# Altium project LaserDiode_Driver.PrjPcb (part 2 of 2)
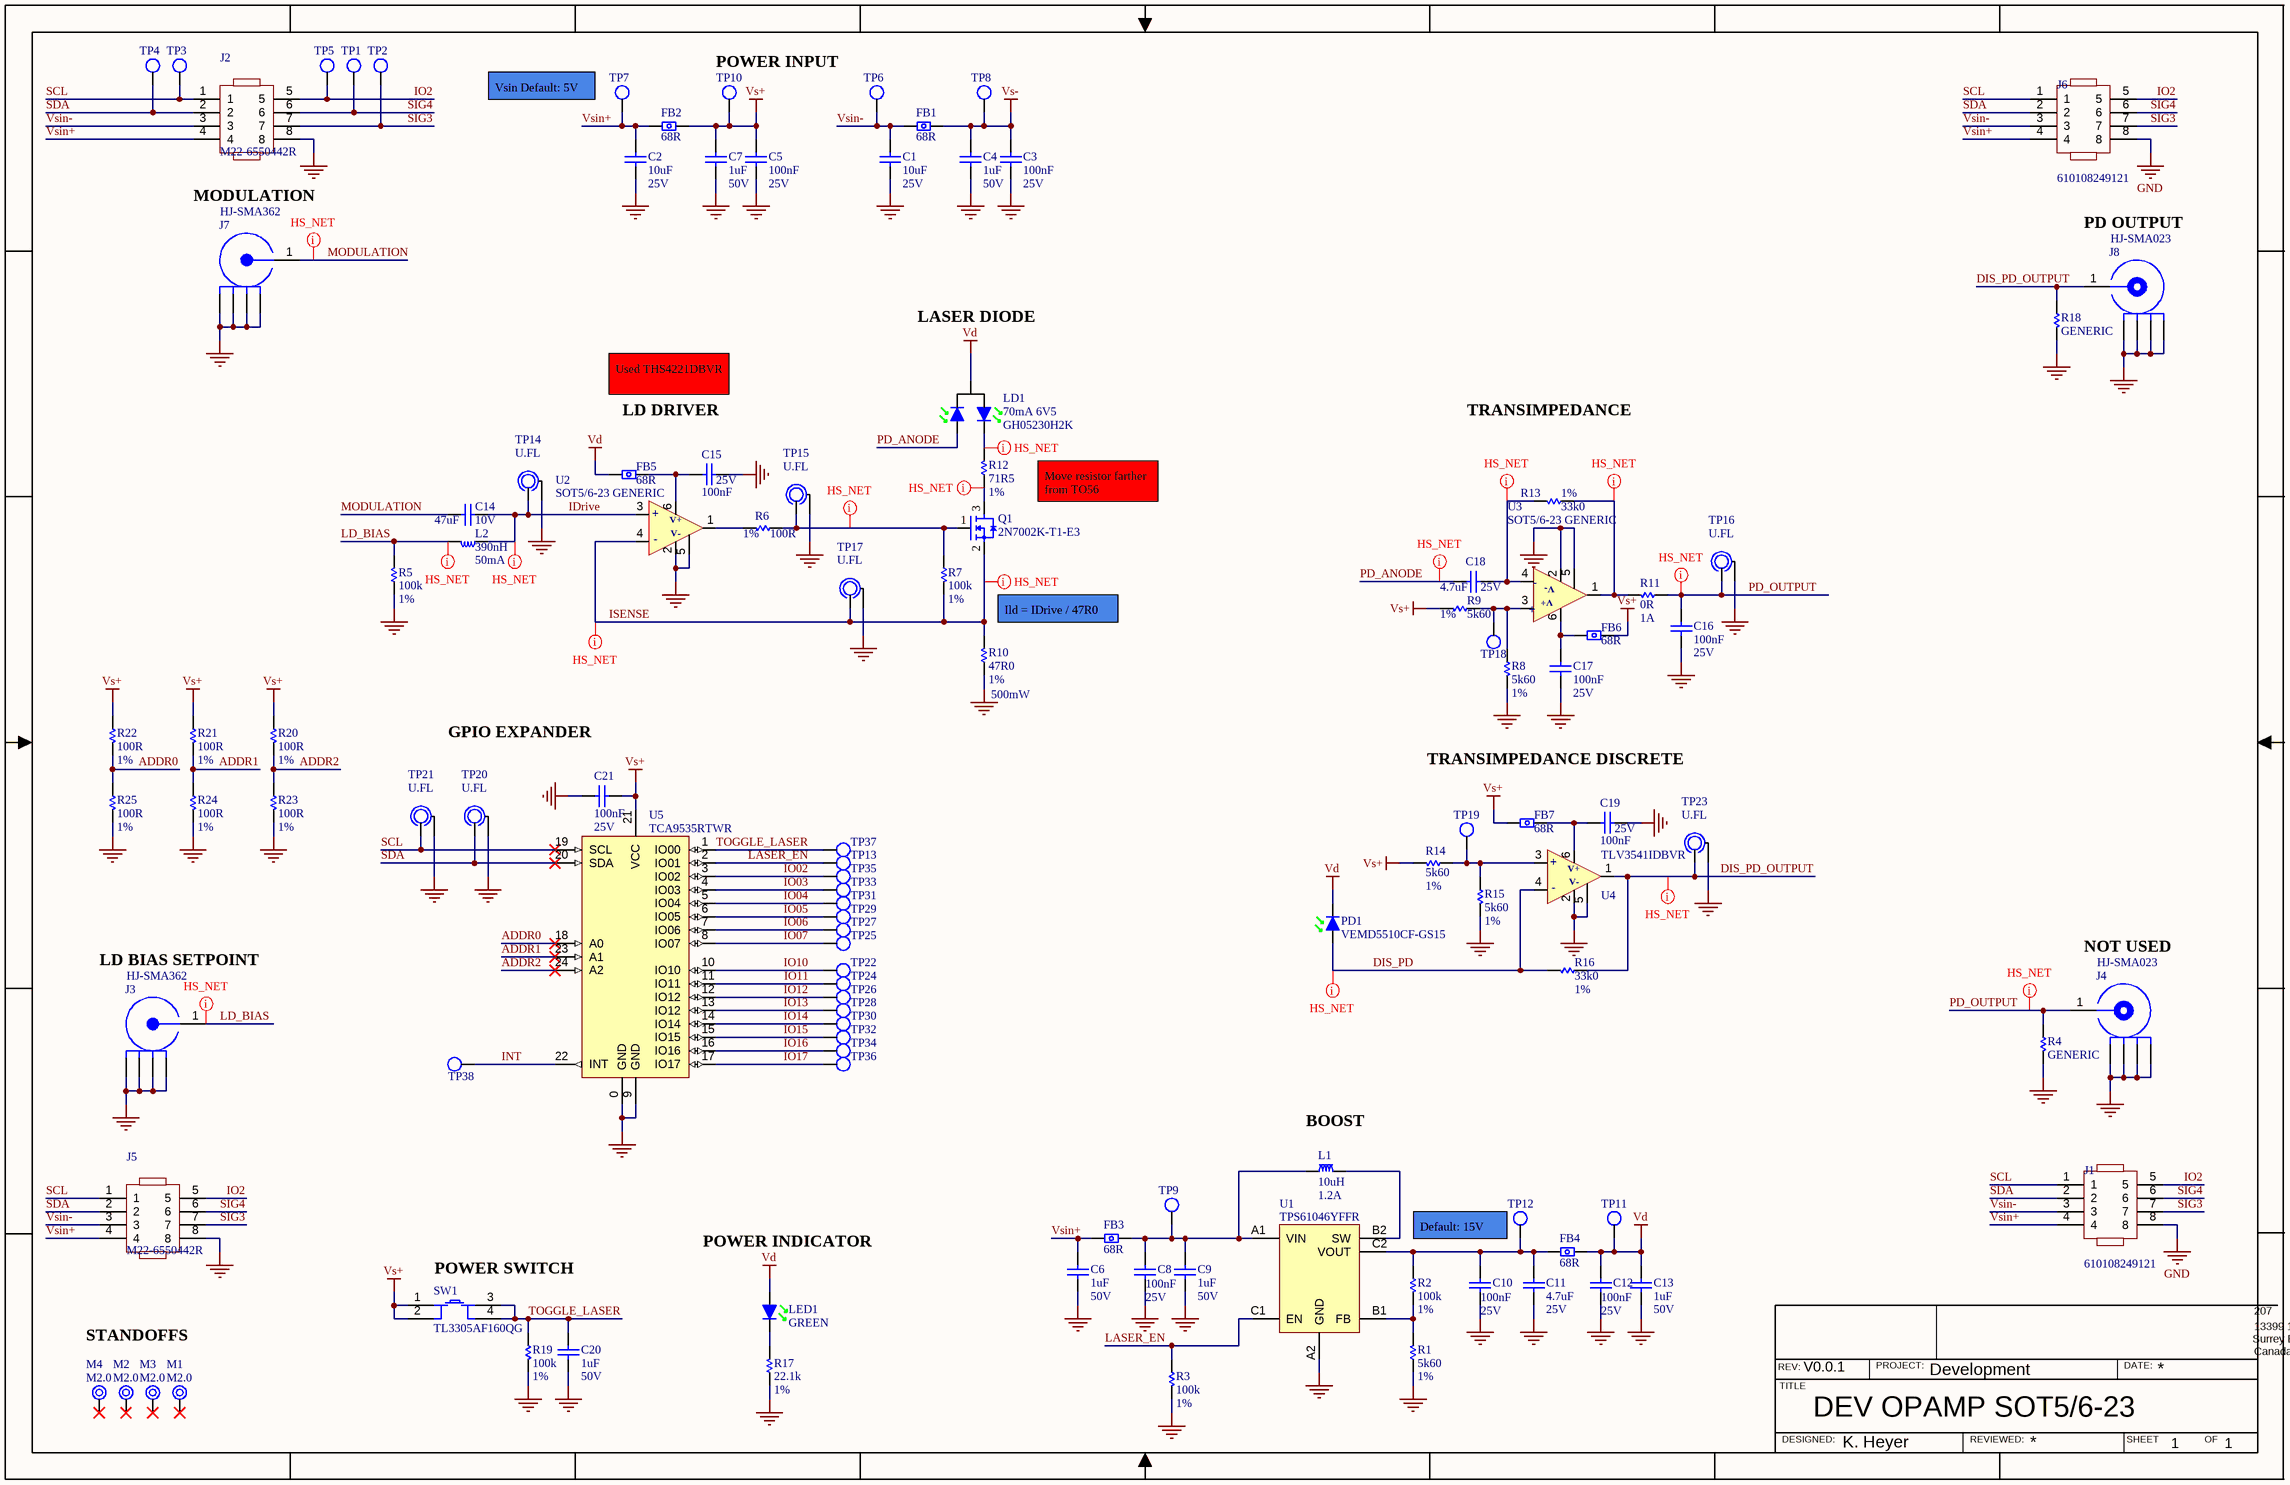
[diagram p1: LaserDiode_Driver.SchDoc]

## Sheet LaserDiode_Driver.SchDoc: DEV OPAMP SOT5/6-23 (continued)

### Library data of the parts
C1 C2 = CAP CER 10uF 25V X5R 0805: Cap Ceramic 10uF 25V X5R 10% SMD 0805 85°C Embossed T/R; Manufacturer: Samsung; Manufacturer Part Number: CL21A106KAYNNNE; Supplier 1: Digi-Key; RoHS: Yes; Category: Ceramic Capacitors; Stock 1: 2266338; Pricing 1: 2000=0.03549, 4000=0.03247 (USD); Mount: Surface Mount; Case/Package: 0805; Case Code (Metric): 2012; Case Code (Imperial): 0805; Min Operating Temperature: -55°C; Max Operating Temperature: 85°C; Package Quantity: 1; Packaging: Tape and Reel; Capacitance: 10uF; Tolerance: 10%; Dielectric: X5R; Series: CL; Construction: Flat; Length: 2mm; Width: 0.049inch; Height: 1.25mm; Depth: 1.25mm; Thickness: 0.057inch; Radiation Hardening: No; RoHS Compliant: Yes; ComponentLink1URL: https://datasheet.ciiva.com/25796/cl21a106kaynnne-25796720.pdf?src-supplier=Digi-Key; ComponentLink1Description: https://datasheet.ciiva.com/25796/cl21a106kaynnne-25796720.pdf?src-supplier=Digi-Key; ComponentLink2URL: https://datasheet.ciiva.com/26838/getdatasheetpartid-357558-26838583.pdf?src-supplier=Verical; ComponentLink2Description: https://datasheet.ciiva.com/26838/getdatasheetpartid-357558-26838583.pdf?src-supplier=Verical; Supplier Part Number 1: 1276-2891-2-ND
C3 C5 C8 C10 C12 C15-C17 C19 C21 = CAP CER 100nF 25V X5R 0402: Cap Ceramic 0.1uF 25V X5R 10% Pad SMD 0402 85¡ãC T/R / Multi Layer Ceramic Capacitor (MLCC); Manufacturer: Samsung; Manufacturer Part Number: CL05A104KA5NNNC; Supplier 1: Digi-Key; RoHS: Yes; Category: Ceramic Capacitors; Stock 1: 8053194; Pricing 1: 1=0.10000, 10=0.01100, 50=0.00600, 100=0.00490, 500=0.00346, 1000=0.00272, 2500=0.00248, 5000=0.00228 (USD); Mount: Surface Mount; Case/Package: 0402; Case Code (Metric): 1005; Case Code (Imperial): 0402; Min Operating Temperature: -55°C; Max Operating Temperature: 85°C; Capacitance: 100nF; Tolerance: 10%; Dielectric: X5R; Packaging: Tape and Reel; Package Quantity: 1; Voltage: 25V; Series: CL; Construction: Flat; Voltage Rating (DC): 25V; Length: 1mm; Width: 0.02inch; Height: 0.5mm; Thickness: 0.022inch; Depth: 0.5mm; Radiation Hardening: No; Lead Free: Lead Free; ComponentLink1URL: https://datasheet.ciiva.com/25802/cl05a104ka5nnnc-25802704.pdf?src-supplier=Digi-Key; ComponentLink1Description: https://datasheet.ciiva.com/25802/cl05a104ka5nnnc-25802704.pdf?src-supplier=Digi-Key; ComponentLink2URL: https://datasheet.ciiva.com/26838/getdatasheetpartid-357412-26838142.pdf?src-supplier=Verical; ComponentLink2Description: https://datasheet.ciiva.com/26838/getdatasheetpartid-357412-26838142.pdf?src-supplier=Verical; ComponentLink3URL: https://datasheet.ciiva.com/16437/cl05a104ka5nnnc-16437369.pdf?src-supplier=Future+Electronics; ComponentLink3Description: https://datasheet.ciiva.com/16437/cl05a104ka5nnnc-16437369.pdf?src-supplier=Future+Electronics; ComponentLink4URL: https://datasheet.ciiva.com/26309/mlcc-catalogdownload2013-eng-26309014.pdf?src-supplier=Distrelec; ComponentLink4Description: https://datasheet.ciiva.com/26309/mlcc-catalogdownload2013-eng-26309014.pdf?src-supplier=Distrelec; Supplier Part Number 1: 1276-1043-1-ND
C4 C6 C7 C9 C13 C20 = CAP CER 1uF 50V X5R 0603: Multilayer Ceramic Capacitors (High dielectric type), 50V, 1 uF, ± 10 %, 0603, X5R, RoHS; Manufacturer: Taiyo Yuden; Manufacturer Part Number: UMK107BJ105KA-T; Tolerance: 10%; Supplier 1: Digi-Key; RoHS: Yes; Category: Ceramic Capacitors; Stock 1: 955108; Pricing 1: 1=0.19000, 10=0.12900, 50=0.07760, 100=0.06560, 500=0.04484, 1000=0.03968 (USD); Mount: Surface Mount; Case/Package: 0603; Number of Pins: 2; Case Code (Metric): 1608; Case Code (Imperial): 0603; Contact Plating: Nickel; Min Operating Temperature: -55°C; Max Operating Temperature: 85°C; Capacitance: 1uF; Packaging: Tape and Reel; Package Quantity: 1; Dielectric: X5R; Voltage Rating (DC): 50V; Termination: SMD/SMT; Series: M; Construction: Flat; Length: 1.6mm; Width: 0.031inch; Height: 0.8mm; Depth: 0.8mm; Thickness: 0.035inch; Radiation Hardening: No; RoHS Compliant: Yes; REACH SVHC: Unknown; Halogen Free: Halogen Free; ComponentLink1URL: https://datasheet.ciiva.com/134/umk107bj105ka-t-ss-134740.pdf?src-supplier=Digi-Key; ComponentLink1Description: https://datasheet.ciiva.com/134/umk107bj105ka-t-ss-134740.pdf?src-supplier=Digi-Key; ComponentLink2URL: https://datasheet.ciiva.com/11601/umk107bj105ka-t-ss-11601811.pdf?src-supplier=Avnet; ComponentLink2Description: https://datasheet.ciiva.com/11601/umk107bj105ka-t-ss-11601811.pdf?src-supplier=Avnet; ComponentLink3URL: https://datasheet.ciiva.com/5744/1697715-5744913.pdf?src-supplier=Farnell; ComponentLink3Description: https://datasheet.ciiva.com/5744/1697715-5744913.pdf?src-supplier=Farnell; ComponentLink4URL: https://datasheet.ciiva.com/30199/43umk107bj105ka-t-30199791.pdf?src-supplier=Onlinecomponents.com; ComponentLink4Description: https://datasheet.ciiva.com/30199/43umk107bj105ka-t-30199791.pdf?src-supplier=Onlinecomponents.com; ComponentLink5URL: https://datasheet.ciiva.com/15922/336umk107bj105ka-t-15922611.pdf?src-supplier=Onlinecomponents.com; ComponentLink5Description: https://datasheet.ciiva.com/15922/336umk107bj105ka-t-15922611.pdf?src-supplier=Onlinecomponents.com; ComponentLink6URL: https://datasheet.ciiva.com/5427/mlcc-all-e-541559-5427036.pdf?src-supplier=Mouser; ComponentLink6Description: https://datasheet.ciiva.com/5427/mlcc-all-e-541559-5427036.pdf?src-supplier=Mouser; ComponentLink7URL: https://datasheet.ciiva.com/7975/mlcc-all-e-7975898.pdf?src-supplier=Element14; ComponentLink7Description: https://datasheet.ciiva.com/7975/mlcc-all-e-7975898.pdf?src-supplier=Element14; ComponentLink8URL: https://datasheet.ciiva.com/7975/1697715-7975608.pdf?src-supplier=Element14; ComponentLink8Description: https://datasheet.ciiva.com/7975/1697715-7975608.pdf?src-supplier=Element14; ComponentLink9URL: https://datasheet.ciiva.com/22694/1697715-22694278.pdf?src-supplier=Element14; ComponentLink9Description: https://datasheet.ciiva.com/22694/1697715-22694278.pdf?src-supplier=Element14; Supplier Part Number 1: 587-2400-1-ND
C11 C18 = CAP CER 4.7uF 25V X5R 0805: Cap Ceramic 4.7uF 25V X5R 10% SMD 0805 85C Embossed T/R; Manufacturer: Samsung; Manufacturer Part Number: CL21A475KAQNNNE; Supplier 1: Digi-Key; RoHS: Yes; Category: Ceramic Capacitors; Stock 1: 3540; Pricing 1: 1=0.11000, 10=0.08000, 50=0.04520, 100=0.03740, 500=0.02624, 1000=0.02172 (USD); Mount: Surface Mount; Case/Package: 0805; Case Code (Metric): 2012; Case Code (Imperial): 0805; Min Operating Temperature: -55°C; Max Operating Temperature: 85°C; Package Quantity: 1; Packaging: Tape and Reel; Capacitance: 4.7uF; Tolerance: 10%; Dielectric: X5R; Voltage Rating (DC): 25V; Series: CL; Construction: Flat; Length: 2mm; Width: 0.049inch; Height: 1.25mm; Thickness: 0.055inch; Depth: 1.25mm; Radiation Hardening: No; Lead Free: Lead Free; RoHS Compliant: Yes; ComponentLink1URL: https://datasheet.ciiva.com/25798/cl21a475kaqnnne-25798882.pdf?src-supplier=Digi-Key; ComponentLink1Description: https://datasheet.ciiva.com/25798/cl21a475kaqnnne-25798882.pdf?src-supplier=Digi-Key; Supplier Part Number 1: 1276-1244-1-ND
C14 = CAP CER 47uF 10V X7R 1210: CAP CER 47UF 10V 20% X7R 1210; Manufacturer: Murata; Manufacturer Part Number: GRM32ER71A476ME15L; Supplier 1: Newark; RoHS: Yes; Category: Ceramic Capacitors; Stock 1: 39686; Pricing 1: 1=0.19500, 10=0.19500, 25=0.19500, 50=0.19500, 100=0.19500 (USD); Mount: Surface Mount; Case/Package: 1210; Case Code (Metric): 3225; Case Code (Imperial): 1210; Min Operating Temperature: -55°C; Max Operating Temperature: 125°C; Capacitance: 47uF; Tolerance: 20%; Packaging: Tape and Reel; Package Quantity: 1; Voltage Rating (DC): 10V; Termination: SMD/SMT; Voltage: 10V; Series: GRM; Construction: Flat; Length: 3.2mm; Width: 0.098inch; Height: 2.5mm; Thickness: 0.106inch; Depth: 2.5mm; Radiation Hardening: No; Reach SVHC Compliant: Yes; Lead Free: Lead Free; RoHS Compliant: Yes; ComponentLink1URL: https://datasheet.ciiva.com/46441/1754712-46441338.pdf?src-supplier=Element14; ComponentLink1Description: https://datasheet.ciiva.com/46441/1754712-46441338.pdf?src-supplier=Element14; ComponentLink2URL: https://datasheet.ciiva.com/6264/partnumbering-e-01-6264587.pdf?src-supplier=Digi-Key; ComponentLink2Description: https://datasheet.ciiva.com/6264/partnumbering-e-01-6264587.pdf?src-supplier=Digi-Key; ComponentLink3URL: https://datasheet.ciiva.com/6264/partnumbering-e-01-6264586.pdf?src-supplier=Digi-Key; ComponentLink3Description: https://datasheet.ciiva.com/6264/partnumbering-e-01-6264586.pdf?src-supplier=Digi-Key; ComponentLink4URL: https://datasheet.ciiva.com/6264/partnumbering-e-01-6264588.pdf?src-supplier=Digi-Key; ComponentLink4Description: https://datasheet.ciiva.com/6264/partnumbering-e-01-6264588.pdf?src-supplier=Digi-Key; ComponentLink5URL: https://datasheet.ciiva.com/11606/product-11606523.pdf?src-supplier=Avnet; ComponentLink5Description: https://datasheet.ciiva.com/11606/product-11606523.pdf?src-supplier=Avnet; ComponentLink6URL: https://datasheet.ciiva.com/16497/product-16497006.pdf?src-supplier=Future+Electronics; ComponentLink6Description: https://datasheet.ciiva.com/16497/product-16497006.pdf?src-supplier=Future+Electronics; Supplier Part Number 1: 40X5909; Dielectric: X7R
FB1-FB7 = FB 68R 400mA 310mR 0402: Ferrite Beads Multi-Layer 68Ohm 25% 100MHz 400mA 310mOhm DCR 0402 T/R; Manufacturer: Taiyo Yuden; Manufacturer Part Number: BK1005LL680-T; DC Resistance (DCR): 310mR; Number of Lines: 1; Shielding: Unshielded; Supplier 1: Digi-Key; RoHS: Yes; Category: Ferrite Beads and Chips; Stock 1: 9707; Pricing 1: 1=0.10000, 10=0.04100, 25=0.03640, 50=0.03300, 100=0.02970, 250=0.02176, 500=0.01584, 1000=0.01551, 5000=0.01056 (USD); Mount: Surface Mount; Case/Package: 0402; Number of Pins: 2; Case Code (Metric): 1005; Case Code (Imperial): 0402; Core Material: Ferrite; Min Operating Temperature: -55°C; Max Operating Temperature: 125°C; Packaging: Tape and Reel; Package Quantity: 1; Impedance: 68R; Tolerance: 25%; Max DC Current: 400mA; Termination: SMD/SMT; Test Frequency: 100MHz; Max Current Rating: 400mA; Series: BK; Frequency: 100MHz; Length: 0.039inch; Width: 0.02inch; Height: 0.022inch; Depth: 0.55mm; Halogen Free: Halogen Free; Lead Free: Lead Free; REACH SVHC: Unknown; ComponentLink1URL: https://datasheet.ciiva.com/1013/bk1005ll680-t-ss-1013936.pdf?src-supplier=Digi-Key; ComponentLink1Description: https://datasheet.ciiva.com/1013/bk1005ll680-t-ss-1013936.pdf?src-supplier=Digi-Key; ComponentLink2URL: https://datasheet.ciiva.com/1013/mlci07-e-1013935.pdf?src-supplier=Digi-Key; ComponentLink2Description: https://datasheet.ciiva.com/1013/mlci07-e-1013935.pdf?src-supplier=Digi-Key; ComponentLink3URL: https://datasheet.ciiva.com/1013/mlci07-e-1013937.pdf?src-supplier=Digi-Key; ComponentLink3Description: https://datasheet.ciiva.com/1013/mlci07-e-1013937.pdf?src-supplier=Digi-Key; Supplier Part Number 1: 587-1860-1-ND
J1 J6 = CONN HDR 08 MALE RA 2 ROW: SMT Angled Pin Header WR-PHD, Pitch 2.54 mm, Dual Row, 8 pins; Manufacturer: Wurth Electronics; Number of Positions: 8; Current Rating: 3A; Gender: Male; Voltage Rating: 250V; Pitch: 0.1inch; Supplier 1: Newark; Manufacturer Part Number: 610108249121; RoHS: Yes; Category: Connectors; Stock 1: 350; Pricing 1: 1=1.53000, 10=1.52000, 25=1.49000, 50=1.46000, 100=1.36000 (USD); Mount: Surface Mount; Contact Plating: Gold; Contact Material: Copper Alloy; Insulation Color: Black; Insulation Material: Nylon; Contact Shape: Square; Connector Type: Header; Fastening Type: Pull; Packaging: Cut Tape; Number of Rows: 2; Termination: Solder; Flammability Rating: UL94 V-0; RoHS Compliant: Yes; ComponentLink1URL: http://www.farnell.com/cad/1889791.pdf?src-supplier=Element14; ComponentLink1Description: http://www.farnell.com/cad/1889791.pdf?src-supplier=Element14; Supplier Part Number 1: 72Y1215; Number of Pins: 8; Color: Black; Contact Finish - Mating: GOLD; Number of Contacts: 8; Series: WR-PHD; Contact Type: Male Pin; Row Spacing: 0.1inch; Contact Mating Length: 0.236inch; ComponentLink2URL: https://katalog.we-online.de/em/datasheet/6101xx249121.pdf?src-supplier=Digi-Key; ComponentLink2Description: https://katalog.we-online.de/em/datasheet/6101xx249121.pdf?src-supplier=Digi-Key; ComponentLink3URL: https://www.distrelec.bizhttp://katalog.we-online.de/em/datasheet/6101xx249121.pdf?mime=application%2Fpdf&src-supplier=Distrelec; ComponentLink3Description: https://www.distrelec.bizhttp://katalog.we-online.de/em/datasheet/6101xx249121.pdf?mime=application%2Fpdf&src-supplier=Distrelec
J2 J5 = CONN HDR 08 FEMALE RA 2 ROW: Conn Socket Strip RCP 8 POS 2mm Solder RA SMD T/R; Manufacturer: Harwin; Current Rating: 2A; Number of Positions: 8; Connector Type: Receptacle,Forked; Supplier 1: Newark; Manufacturer Part Number: M22-6550442R; RoHS: Yes; Category: Connectors; Stock 1: 750; Pricing 1: 1=1.17000, 100=0.91900, 250=0.84000, 500=0.76600, 1000=0.71200 (USD); Mount: Surface Mount; Contact Material: Bronze; Contact Plating: Gold; Contact Shape: Square; Insulation Material: Polymer; Insulation Color: Black; Packaging: Cut Tape; Number of Rows: 2; Termination: Solder; Fastening Type: Push,Pull; RoHS Compliant: Yes; Flammability Rating: UL94 V-0; ComponentLink1URL: https://cdn.harwin.com/pdfs/M22-655R.pdf?src-supplier=Digi-Key; ComponentLink1Description: https://cdn.harwin.com/pdfs/M22-655R.pdf?src-supplier=Digi-Key; Supplier Part Number 1: 45AJ6425; Min Operating Temperature: -40°C; Max Operating Temperature: 105°C
J3 J7 = CON SMA PIN SMD BRD EDGE HJ-SMA362
J4 J8 = CON SMA BORE SMD BRD EDGE HJ-SMA023
L1 = IND 10uH 1.2A 180mR 4040 NRS4018T100MDGJ: Inductor Power Shielded Wirewound 10uH 20% 100KHz Ferrite 1.2A 0.18Ohm DCR 1515 T/R; Manufacturer: Taiyo Yuden; Self Resonant Frequency: 25MHz; Saturation Current: 1.3A; DC Resistance (DCR): 180mR; Supplier 1: Newark; Manufacturer Part Number: NRS4018T100MDGJ; RoHS: Yes; Category: Fixed Inductors; Stock 1: 105000; Pricing 1: 3500=0.14600, 7000=0.14500 (CAD); Mount: Surface Mount; Case/Package: 4018; Number of Pins: 2; Core Material: Ferrite; Min Operating Temperature: -25°C; Max Operating Temperature: 125°C; Package Quantity: 3500; Packaging: Tape and Reel; Tolerance: 20%; Inductance: 10uH; Shielding: Shielded; Max DC Current: 1.2A; Termination: SMD/SMT; Resistor Type: Wirewound; Test Frequency: 100kHz; Inductance Tolerance: 20%; RMS Current (Irms): 1.2A; Series: NRS; Length: 4mm; Width: 0.157inch; Height: 1.8mm; Height - Seated (Max): 0.071inch; Depth: 4.2mm; Lead Pitch: 2.8mm; Radiation Hardening: No; Halogen Free: Halogen Free; RoHS Compliant: Yes; Lead Free: Lead Free; Reach SVHC Compliant: Yes; ComponentLink1URL: https://datasheet.ciiva.com/7197/nrs4018t100mdgj-ss-7197570.pdf?src-supplier=Newark; ComponentLink1Description: https://datasheet.ciiva.com/7197/nrs4018t100mdgj-ss-7197570.pdf?src-supplier=Newark; ComponentLink2URL: https://datasheet.ciiva.com/25607/0900766b810b3cd2-25607943.pdf?src-supplier=RSComponents; ComponentLink2Description: https://datasheet.ciiva.com/25607/0900766b810b3cd2-25607943.pdf?src-supplier=RSComponents; ComponentLink3URL: https://datasheet.ciiva.com/8504/nrs4018t100mdgj-ss-8504500.pdf?src-supplier=Avnet; ComponentLink3Description: https://datasheet.ciiva.com/8504/nrs4018t100mdgj-ss-8504500.pdf?src-supplier=Avnet; Supplier Part Number 1: 26AC2706
L2 = IND HF 390nH 50mA 8R 0402: Inductor High Frequency Chip Unshielded Multi-Layer 390nH 5% 50MHz 6Q-Factor Ceramic 50mA 8Ohm DCR 0402 T/R; Manufacturer: TDK; Manufacturer Part Number: MLG1005SR39JT000; Core Material: Non-Magnetic; DC Resistance (DCR): 8R; Self Resonant Frequency: 300MHz; Supplier 1: Newark; RoHS: Yes; Category: Fixed Inductors; Stock 1: 9470; Pricing 1: 1=0.13000, 10=0.08700, 25=0.08200, 50=0.07600, 100=0.07100 (USD); Mount: Surface Mount; Case/Package: 0402; Case Code (Metric): 1005; Case Code (Imperial): 0402; Min Operating Temperature: -55°C; Max Operating Temperature: 125°C; Package Quantity: 10000; Packaging: Tape and Reel; Tolerance: 5%; Shielding: Unshielded; Inductance: 390nH; Test Frequency: 50MHz; Length: 0.039inch; Width: 0.02inch; Height - Seated (Max): 0.022inch; RoHS Compliant: Yes; ComponentLink1URL: https://datasheet.ciiva.com/29690/inductor-commercial-high-frequency-mlg-en-29690424.pdf?src-supplier=Digi-Key; ComponentLink1Description: https://datasheet.ciiva.com/29690/inductor-commercial-high-frequency-mlg-en-29690424.pdf?src-supplier=Digi-Key; ComponentLink2URL: https://datasheet.ciiva.com/29690/inductor-commercial-high-frequency-mlg-en-29690423.pdf?src-supplier=Digi-Key; ComponentLink2Description: https://datasheet.ciiva.com/29690/inductor-commercial-high-frequency-mlg-en-29690423.pdf?src-supplier=Digi-Key; ComponentLink3URL: https://datasheet.ciiva.com/29690/inductor-commercial-high-frequency-mlg-en-29690425.pdf?src-supplier=Digi-Key; ComponentLink3Description: https://datasheet.ciiva.com/29690/inductor-commercial-high-frequency-mlg-en-29690425.pdf?src-supplier=Digi-Key; Supplier Part Number 1: 69AH1243
LD1 = LD TYPE A GREEN 30mW GH05230H2K: Manufacturer: Sharp; Supplier 1: Mouser; Stock 1: 1976; Pricing 1: 1=6.31000, 10=4.45000, 50=4.45000, 100=3.64000, 1000=2.99000, 10000=2.89000 (USD); Supplier Part Number 1: 852-GH05230H2K
LED1 = LED GREEN CLEAR 0402: LED GREEN CLEAR 0402 SMD; Manufacturer: Kingbright; Manufacturer Part Number: APHHS1005CGCK; Forward Current: 20mA; Forward Voltage: 2.1V; Luminous Intensity: 50mcd; Viewing Angle: 120°; Lens Style: Clear,Flat; Dominant Wavelength: 570nm; Number of LEDs: 1; Supplier 1: Future Electronics; RoHS: Yes; Category: LEDs; Stock 1: 6000; Pricing 1: 2000=0.08900, 6000=0.07440, 10000=0.07360, 30000=0.07200, 50000=0.07120 (USD); Mount: Surface Mount; Case/Package: 0402; Number of Pins: 2; Color: Green; Case Code (Metric): 1005; Case Code (Imperial): 0402; Lens Color: Clear; Min Operating Temperature: -40°C; Max Operating Temperature: 85°C; Packaging: Tape and Reel; Package Quantity: 2000; Test Current: 20mA; Series: APHHS; Illumination Color: Green; Wavelength: 570nm; Length: 1mm; Width: 0.5mm; Height: 0.6mm; Lead Free: Lead Free; RoHS Compliant: Yes; ComponentLink1URL: https://datasheet.ciiva.com/4688/aphhs1005cgck-38896-4688761.pdf?src-supplier=Mouser; ComponentLink1Description: https://datasheet.ciiva.com/4688/aphhs1005cgck-38896-4688761.pdf?src-supplier=Mouser; ComponentLink2URL: https://datasheet.ciiva.com/2113/aphhs1005cgck-2113972.pdf?src-supplier=Digi-Key; ComponentLink2Description: https://datasheet.ciiva.com/2113/aphhs1005cgck-2113972.pdf?src-supplier=Digi-Key; ComponentLink3URL: https://datasheet.ciiva.com/2113/aphhs1005cgck-2113973.pdf?src-supplier=Digi-Key; ComponentLink3Description: https://datasheet.ciiva.com/2113/aphhs1005cgck-2113973.pdf?src-supplier=Digi-Key; ComponentLink4URL: https://datasheet.ciiva.com/2113/aphhs1005cgck-2113974.pdf?src-supplier=Digi-Key; ComponentLink4Description: https://datasheet.ciiva.com/2113/aphhs1005cgck-2113974.pdf?src-supplier=Digi-Key; Supplier Part Number 1: 5437918
M1-M4 = MECH M2.0 UNPLATED
PD1 = DIODE PHOTO 540nm 20V VEMD5510CF-GS15: Photodiode PIN Chip 540nm 4-Pin SMD T/R; Manufacturer 1: Vishay Semiconductors; Response Time: 70ns; Max Reverse Voltage (DC): 20V; Dark Current: 200pA; Viewing Angle: 130°; Supplier 1: Mouser; Supplier Part Number 1: 78-VEMD5510CF-GS15; Manufacturer Part Number 1: VEMD5510CF-GS15; RoHS 1: Yes; Description 1: Photodiode PIN Chip 540nm 4-Pin SMD T/R; Stock 1: 678; Pricing 1: 1=2.27, 10=1.52, 50=1.52, 100=1.17, 1000=0.855, 10000=0.824 (USD); Mounting Technology: Surface Mount; Case/Package: SMD/SMT; Min Operating Temperature: -40°C; Max Operating Temperature: 100°C; Wavelength: 540nm; Diode Type: PIN; ComponentLink1URL: http://www.vishay.com/docs/84387/vemd5510cf.pdf?src-supplier=Digi-Key; ComponentLink1Description: http://www.vishay.com/docs/84387/vemd5510cf.pdf?src-supplier=Digi-Key
Q1 = TRANS NMOS 60V SOT-23-3 2N7002K-T1-E3: Trans MOSFET N-CH 60V 0.3A 3-Pin SOT-23 T/R - Tape and Reel (Alt: 2N7002K-T1-E3); Manufacturer: Vishay Siliconix; Nominal Vgs: 2V; Rds On Max: 2R; Input Capacitance: 30pF; Number of Elements: 1; Max Power Dissipation: 200mW; Continuous Drain Current (ID): 300mA; Drain to Source Breakdown Voltage: 70V; Drain to Source Resistance: 7.5R; Gate to Source Voltage (Vgs): 20V; Turn-Off Delay Time: 35ns; Power Dissipation: 350mW; Turn-On Delay Time: 25ns; Element Configuration: Single; Polarity: N-CHANNEL; Polarization: N; Supplier 1: Newark; Manufacturer Part Number: 2N7002K-T1-E3; RoHS: Yes; Category: MOSFETs; Stock 1: 29333; Pricing 1: 1=0.38000, 25=0.31000, 50=0.26100, 100=0.21200, 250=0.18600, 500=0.15900 (USD); Mount: Surface Mount; Case/Package: SOT-23-3; Number of Pins: 3; Weight: 0.050717oz; Min Operating Temperature: -55°C; Max Operating Temperature: 150°C; Packaging: Tape and Reel; Package Quantity: 1; Drain to Source Voltage (Vdss): 60V; Threshold Voltage: 2V; Number of Channels: 1; On-State Resistance: 2R; Series: TrenchFET®; Drain-source On Resistance-Max: 2R; Length: 3.04mm; Width: 1.4mm; Height: 1.02mm; Radiation Hardening: No; Lead Free: Lead Free; RoHS Compliant: Yes; ComponentLink1URL: https://datasheet.ciiva.com/15137/getdatasheetpartid-75158-15137377.pdf?src-supplier=Verical; ComponentLink1Description: https://datasheet.ciiva.com/15137/getdatasheetpartid-75158-15137377.pdf?src-supplier=Verical; ComponentLink2URL: https://datasheet.ciiva.com/1254/70226-1254497.pdf?src-supplier=Newark; ComponentLink2Description: https://datasheet.ciiva.com/1254/70226-1254497.pdf?src-supplier=Newark; ComponentLink3URL: https://datasheet.ciiva.com/4440/70226-240087-4440695.pdf?src-supplier=Mouser; ComponentLink3Description: https://datasheet.ciiva.com/4440/70226-240087-4440695.pdf?src-supplier=Mouser; ComponentLink4URL: https://datasheet.ciiva.com/8084/2n7002k-8084215.pdf?src-supplier=Avnet; ComponentLink4Description: https://datasheet.ciiva.com/8084/2n7002k-8084215.pdf?src-supplier=Avnet; ComponentLink5URL: https://datasheet.ciiva.com/6367/2n7002k-6367013.pdf?src-supplier=Digi-Key; ComponentLink5Description: https://datasheet.ciiva.com/6367/2n7002k-6367013.pdf?src-supplier=Digi-Key; ComponentLink6URL: https://datasheet.ciiva.com/6367/2n7002k-6367016.pdf?src-supplier=Digi-Key; ComponentLink6Description: https://datasheet.ciiva.com/6367/2n7002k-6367016.pdf?src-supplier=Digi-Key; ComponentLink7URL: https://datasheet.ciiva.com/16376/2n7002k-16376713.pdf?src-supplier=Future+Electronics; ComponentLink7Description: https://datasheet.ciiva.com/16376/2n7002k-16376713.pdf?src-supplier=Future+Electronics; ComponentLink8URL: https://datasheet.ciiva.com/7788/2n7002k-7788909.pdf?src-supplier=Element14; ComponentLink8Description: https://datasheet.ciiva.com/7788/2n7002k-7788909.pdf?src-supplier=Element14; ComponentLink9URL: https://datasheet.ciiva.com/22749/1911668-22749621.pdf?src-supplier=Element14; ComponentLink9Description: https://datasheet.ciiva.com/22749/1911668-22749621.pdf?src-supplier=Element14; Supplier Part Number 1: 06J8894
R1 R8 R9 R14 R15 = RES 5k60 1% 63mW 0402: Res Thick Film 0402 5.6K Ohm 1% 0.063W(1/16W) ±100ppm/C Epoxy SMD T/R; Manufacturer: Yageo; Manufacturer Part Number: RC0402FR-075K6L; Resistance: 5.6kR; Power Rating: 62.5mW; Voltage Rating: 50V; Temperature Coefficient: 100ppm/°C; Supplier 1: Newark; RoHS: Yes; Category: Chip SMD Resistors; Stock 1: 100000; Pricing 1: 1=0.00100, 10000=0.00100 (USD); Case/Package: Molded; Case Code (Imperial): 0402; Case Code (Metric): 1005; Size Code: 0402; Min Operating Temperature: -55°C; Max Operating Temperature: 155°C; Packaging: Tape and Reel; Termination: SMD/SMT; Resistor Type: Thick Film; Series: RC; Construction: Rectangular; Resistance Tolerance: 1%; Length: 1mm; Depth: 0.5mm; Military Standard: Not; Lead Free: Lead Free; RoHS Compliant: Yes; ComponentLink1URL: https://datasheet.ciiva.com/12667/pyu-rc0402-51-rohs-l-6-r-12667035.pdf?src-supplier=Mouser; ComponentLink1Description: https://datasheet.ciiva.com/12667/pyu-rc0402-51-rohs-l-6-r-12667035.pdf?src-supplier=Mouser; Supplier Part Number 1: 12AC2081
R2 R3 R5 R7 R19 = RES 100k 1% 63mW 0402: Res Thick Film 0402 100K Ohm 1% 0.063W ±100ppm/°C Molded SMD Paper T/R; Manufacturer: Stackpole Electronics; Manufacturer Part Number: RMCF0402FT100K; Resistance: 100kR; Power Rating: 62.5mW; Max Power Dissipation: 63mW; Supplier 1: Avnet; RoHS: Yes; Category: Chip SMD Resistors; Stock 1: 3260000; Pricing 1: 10000=0.00170, 20000=0.00168, 40000=0.00163, 60000=0.00160, 80000=0.00154, 100000=0.00150, 1000000=0.00146 (USD); Mount: Surface Mount; Case/Package: 0402; Case Code (Metric): 1005; Case Code (Imperial): 0402; Contact Plating: Tin,Matte; Size Code: 0402; Min Operating Temperature: -55°C; Max Operating Temperature: 155°C; Packaging: Tape and Reel; Resistor Type: Thick Film; Number of Terminations: 2; Temperature Coefficient: 100ppm/°C; Features: Automotive AEC-Q200; Series: RMCF; Construction: Rectangular; Length: 1mm; Width: 0.02inch; Height: 0.016inch; Depth: 0.5mm; Radiation Hardening: No; Military Standard: Not; Lead Free: Lead Free; RoHS Compliant: Yes; ComponentLink1URL: https://datasheet.ciiva.com/15193/getdatasheetpartid-482656-15193415.pdf?src-supplier=Verical; ComponentLink1Description: https://datasheet.ciiva.com/15193/getdatasheetpartid-482656-15193415.pdf?src-supplier=Verical; Supplier Part Number 1: RMCF0402FT100K
  R7: Value: 100k
R4 R18 = RES GENERIC 0402
R6 R20-R25 = RES 100R 63mW 1% 0402: Res General Purpose Thick Film 0402 100 Ohm 1% 1/16W ±100ppm/°C Molded SMD Paper T/R; Manufacturer: Yageo; Manufacturer Part Number: RC0402FR-07100RL; Power Rating: 62.5mW; Voltage Rating: 50V; Max Power Dissipation: 63mW; Value: 100; Supplier 1: Newark; RoHS: Yes; Category: Chip SMD Resistors; Stock 1: 4390000; Pricing 1: 1=0.00100, 10000=0.00100 (USD); Case/Package: 0402; Number of Pins: 2; Case Code (Imperial): 0402; Case Code (Metric): 1005; Size Code: 0402; Min Operating Temperature: -55°C; Max Operating Temperature: 155°C; Voltage Rating (DC): 50V; Resistance: 100R; Packaging: Tape and Reel; Termination: SMD/SMT; Resistor Type: Thick Film; Temperature Coefficient: 100ppm/°C; Features: Moisture Resistant; Series: RC; Number of Terminations: 2; Resistance Tolerance: 1%; Construction: Rectangular; Technology: THICK FILM; Length: 1mm; Width: 0.5mm; Height: 0.32mm; Depth: 0.5mm; RoHS Compliant: Yes; Reach SVHC Compliant: Yes; Military Standard: Not; Lead Free: Lead Free; ComponentLink1URL: https://datasheet.ciiva.com/11808/0900766b80c66297-11808765.pdf?src-supplier=RSComponents; ComponentLink1Description: https://datasheet.ciiva.com/11808/0900766b80c66297-11808765.pdf?src-supplier=RSComponents; ComponentLink2URL: https://datasheet.ciiva.com/7849/1784430-7849810.pdf?src-supplier=Element14; ComponentLink2Description: https://datasheet.ciiva.com/7849/1784430-7849810.pdf?src-supplier=Element14; ComponentLink3URL: https://datasheet.ciiva.com/28367/1018594-28367226.pdf?src-supplier=Element14; ComponentLink3Description: https://datasheet.ciiva.com/28367/1018594-28367226.pdf?src-supplier=Element14; ComponentLink4URL: https://datasheet.ciiva.com/22747/1018594-22747511.pdf?src-supplier=Element14; ComponentLink4Description: https://datasheet.ciiva.com/22747/1018594-22747511.pdf?src-supplier=Element14; ComponentLink5URL: https://datasheet.ciiva.com/12667/pyu-rc0402-51-rohs-l-6-r-12667957.pdf?src-supplier=Mouser; ComponentLink5Description: https://datasheet.ciiva.com/12667/pyu-rc0402-51-rohs-l-6-r-12667957.pdf?src-supplier=Mouser; ComponentLink6URL: https://datasheet.ciiva.com/15189/getdatasheetpartid-329466-15189335.pdf?src-supplier=Verical; ComponentLink6Description: https://datasheet.ciiva.com/15189/getdatasheetpartid-329466-15189335.pdf?src-supplier=Verical; ComponentLink7URL: https://datasheet.ciiva.com/16740/pyu-rc0402-51-rohs-l-6-r-16740566.pdf?src-supplier=Future+Electronics; ComponentLink7Description: https://datasheet.ciiva.com/16740/pyu-rc0402-51-rohs-l-6-r-16740566.pdf?src-supplier=Future+Electronics; Supplier Part Number 1: 45Y6897
R10 = RES 47R0 1% 500mW 0805: Res Thick Film 0805 47 Ohm 1% 0.5W(1/2W) ±100ppm/C Pad SMD Automotive T/R; Manufacturer 1: Vishay; Manufacturer Part Number 1: CRCW080547R0FKEAHP; Category 1: Chip SMD Resistors; Value: 47R; Voltage Rating: 150V; Temperature Coefficient: 100ppm/°C; Supplier 1: Mouser; Supplier Part Number 1: 71-CRCW080547R0FKEAH; RoHS 1: Yes; Description 1: Res Thick Film 0805 47 Ohm 1% 0.5W(1/2W) ±100ppm/C Pad SMD Automotive T/R; Stock 1: 6535; Pricing 1: 1=0.21, 10=0.103, 50=0.103, 100=0.07, 1000=0.029, 10000=0.024 (USD); Case/Package: 0805; Case Code (Imperial): 0805; Case Code (Metric): 2012; Min Operating Temperature: -55°C; Max Operating Temperature: 155°C; Packaging: Tape and Reel; Package Quantity: 5000; Power Rating: 500mW; Resistor Type: Thick Film; Termination: SMD/SMT; Number of Terminations: 2; Voltage Rating (DC): 150V; Features: Automotive AEC-Q200; Series: CRCW-HP; Technology: THICK FILM; Resistance Tolerance: 1%; Length: 2mm; Width: 1.25mm; Height: 0.024inch; Depth: 1.25mm; Lead Free: Lead Free; RoHS Compliant: Yes; Reach SVHC Compliant: Unknown; ComponentLink1URL: https://datasheet.ciiva.com/2581/crcwhpe3-2581410.pdf?src-supplier=Digi-Key; ComponentLink1Description: https://datasheet.ciiva.com/2581/crcwhpe3-2581410.pdf?src-supplier=Digi-Key; ComponentLink2URL: https://datasheet.ciiva.com/7777/424479-7777413.pdf?src-supplier=Element14; ComponentLink2Description: https://datasheet.ciiva.com/7777/424479-7777413.pdf?src-supplier=Element14
R11 = RES 0R 63mW 0402: GLOVE, POLYAMIDE, L/FREE, PU, SIZE 6 - More Details; Manufacturer: Stackpole Electronics; Manufacturer Part Number: RMCF0402ZT0R00; Power Rating: 63mW; Working Voltage: 50V; Supplier 1: Digi-Key; RoHS: Yes; Category: Chip SMD Resistors; Stock 1: 5203223; Pricing 1: 1=0.10000, 10=0.01000, 25=0.00720, 50=0.00560, 100=0.00410, 250=0.00316, 500=0.00252, 1000=0.00186, 5000=0.00133 (USD); Mount: Surface Mount; Case/Package: 0402; Case Code (Metric): 1005; Case Code (Imperial): 0402; Contact Plating: Tin,Matte; Min Operating Temperature: -55°C; Max Operating Temperature: 155°C; Resistance: 0R; Packaging: Tape and Reel; Resistor Type: Thick Film; Number of Terminations: 2; Max Power Dissipation: 63mW; Features: Automotive AEC-Q200; Series: RMCF; Technology: THICK FILM; Construction: Rectangular; Length: 0.039inch; Width: 0.02inch; Height: 0.016inch; Depth: 0.5mm; Radiation Hardening: No; Military Standard: Not; Lead Free: Lead Free; RoHS Compliant: Yes; ComponentLink1URL: https://datasheet.ciiva.com/26835/getdatasheetpartid-409751-26835612.pdf?src-supplier=Verical; ComponentLink1Description: https://datasheet.ciiva.com/26835/getdatasheetpartid-409751-26835612.pdf?src-supplier=Verical; Supplier Part Number 1: RMCF0402ZT0R00CT-ND
R12 = RES 71R5 1% 500mW 0402: Res Thick Film 0805 71.5 Ohm 1% 0.25W ±100ppm/°C Molded SMD Punched Carrier T/R; Manufacturer 1: Panasonic; Manufacturer Part Number 1: ERJ-P06F71R5V; Category 1: Chip SMD Resistors; Value: 71.5R; Power Rating: 500mW; Voltage Rating: 150V; Voltage Rating (DC): 400V; Supplier 1: Mouser; Supplier Part Number 1: 667-ERJ-P06F71R5V; RoHS 1: Yes; Description 1: Res Thick Film 0805 71.5 Ohm 1% 0.25W ±100ppm/°C Molded SMD Punched Carrier T/R; Stock 1: 10677; Pricing 1: 1=0.2, 10=0.171, 50=0.171, 100=0.071, 1000=0.071, 10000=0.026 (USD); Mounting Technology: Surface Mount; Case/Package: 0805; Case Code (Imperial): 0805; Case Code (Metric): 2012; Min Operating Temperature: -55°C; Max Operating Temperature: 155°C; Packaging: Tape and Reel; Package Quantity: 5000; Resistor Type: Thick Film; Termination: SMD/SMT; Temperature Coefficient: 100ppm/°C; Series: ERJ-P06; Resistance Tolerance: 1%; Length: 2mm; Width: 1.2mm; Height: 0.6mm; Reach SVHC Compliant: No; RoHS Compliant: Yes; ComponentLink1URL: https://datasheet.ciiva.com/24071/aoa0000ce4-64075-24071276.pdf?src-supplier=Mouser; ComponentLink1Description: https://datasheet.ciiva.com/24071/aoa0000ce4-64075-24071276.pdf?src-supplier=Mouser; ComponentLink2URL: https://datasheet.ciiva.com/22724/1801181-22724490.pdf?src-supplier=Element14; ComponentLink2Description: https://datasheet.ciiva.com/22724/1801181-22724490.pdf?src-supplier=Element14
R13 R16 = RES 33k0 1% 100mW 0603: SMD Chip Resistor, 33 kOhm, ± 1%, 100 mW, 0603 [1608 Metric], Thick Film, General Purpose; Manufacturer 1: Yageo; Manufacturer Part Number 1: RC0603FR-0733KL; Category 1: Chip SMD Resistors; Value: 33kR; Voltage Rating (DC): 50V; Temperature Coefficient: 100ppm/°C; Power Rating: 100mW; Supplier 1: Future Electronics; Supplier Part Number 1: 9831728; RoHS 1: Yes; Description 1: SMD Chip Resistor, 33 kOhm, ± 1%, 100 mW, 0603 [1608 Metric], Thick Film, General Purpose; Stock 1: 1174000; Pricing 1: 5000=0.0014, 50000=0.0013, 200000=0.0012, 625000=0.0012, 2000000=0.0011 (USD); Case/Package: 0603; Pins: 2; Case Code (Imperial): 0603; Case Code (Metric): 1608; Min Operating Temperature: -55°C; Max Operating Temperature: 155°C; Packaging: Tape and Reel; Termination: SMD/SMT; Resistor Type: Thick Film; Series: RC; Voltage Rating: 50V; Package Quantity: 1; Number of Terminations: 2; Max Power Dissipation: 100mW; Features: Moisture Resistant; Resistance Tolerance: 1%; Construction: Rectangular; Length: 0.063inch; Width: 0.031inch; Height: 0.022inch; Depth: 0.8mm; Reach SVHC Compliant: No; Lead Free: Lead Free; Military Standard: Not; RoHS Compliant: Yes; ComponentLink1URL: https://datasheet.ciiva.com/46395/443971-46395005.pdf?src-supplier=Element14; ComponentLink1Description: https://datasheet.ciiva.com/46395/443971-46395005.pdf?src-supplier=Element14; ComponentLink2URL: https://datasheet.ciiva.com/2454/pyu-r-int-thick-7-2454010.pdf?src-supplier=Digi-Key; ComponentLink2Description: https://datasheet.ciiva.com/2454/pyu-r-int-thick-7-2454010.pdf?src-supplier=Digi-Key; ComponentLink3URL: https://datasheet.ciiva.com/2454/pyu-r-int-thick-7-2454011.pdf?src-supplier=Digi-Key; ComponentLink3Description: https://datasheet.ciiva.com/2454/pyu-r-int-thick-7-2454011.pdf?src-supplier=Digi-Key; ComponentLink4URL: https://datasheet.ciiva.com/2454/pyu-r-int-thick-7-2454009.pdf?src-supplier=Digi-Key; ComponentLink4Description: https://datasheet.ciiva.com/2454/pyu-r-int-thick-7-2454009.pdf?src-supplier=Digi-Key; ComponentLink5URL: https://datasheet.ciiva.com/7746/443971-7746332.pdf?src-supplier=Element14; ComponentLink5Description: https://datasheet.ciiva.com/7746/443971-7746332.pdf?src-supplier=Element14; ComponentLink6URL: https://datasheet.ciiva.com/7746/443971-7746333.pdf?src-supplier=Element14; ComponentLink6Description: https://datasheet.ciiva.com/7746/443971-7746333.pdf?src-supplier=Element14; ComponentLink7URL: https://datasheet.ciiva.com/15189/getdatasheetpartid-353493-15189706.pdf?src-supplier=Verical; ComponentLink7Description: https://datasheet.ciiva.com/15189/getdatasheetpartid-353493-15189706.pdf?src-supplier=Verical
R17 = RES 22.1k 1% 63mW 0402: Res Thick Film 0402 22.1K Ohm 1% 0.063W(1/16W) ±100ppm/°C Pad SMD T/R; Manufacturer: Yageo; Manufacturer Part Number: RC0402FR-0722K1L; Resistance: 22.1kR; Power Rating: 62.5mW; Voltage Rating: 50V; Max Power Dissipation: 63mW; Supplier 1: Newark; RoHS: Yes; Category: Chip SMD Resistors; Stock 1: 107993; Pricing 1: 1=0.06100, 10=0.00800, 25=0.00600, 50=0.00500, 100=0.00300 (USD); Case/Package: 0402; Case Code (Metric): 1005; Case Code (Imperial): 0402; Min Operating Temperature: -55°C; Max Operating Temperature: 155°C; Package Quantity: 1; Packaging: Tape and Reel; Resistor Type: Thick Film; Number of Terminations: 2; Termination: SMD/SMT; Temperature Coefficient: 100ppm/°C; Voltage Rating (DC): 50V; Working Voltage: 50V; Features: Moisture Resistant; Series: RC; Technology: THICK FILM; Resistance Tolerance: 1%; Construction: Rectangular; Length: 0.039inch; Width: 0.02inch; Height: 0.016inch; Depth: 0.5mm; Reach SVHC Compliant: Yes; Military Standard: Not; Lead Free: Lead Free; RoHS Compliant: Yes; ComponentLink1URL: https://datasheet.ciiva.com/7983/1018594-7983501.pdf?src-supplier=Element14; ComponentLink1Description: https://datasheet.ciiva.com/7983/1018594-7983501.pdf?src-supplier=Element14; ComponentLink2URL: https://datasheet.ciiva.com/2553/pyu-r-int-thick-7-2553201.pdf?src-supplier=Digi-Key; ComponentLink2Description: https://datasheet.ciiva.com/2553/pyu-r-int-thick-7-2553201.pdf?src-supplier=Digi-Key; ComponentLink3URL: https://datasheet.ciiva.com/2553/pyu-r-int-thick-7-2553202.pdf?src-supplier=Digi-Key; ComponentLink3Description: https://datasheet.ciiva.com/2553/pyu-r-int-thick-7-2553202.pdf?src-supplier=Digi-Key; ComponentLink4URL: https://datasheet.ciiva.com/2553/pyu-r-int-thick-7-2553200.pdf?src-supplier=Digi-Key; ComponentLink4Description: https://datasheet.ciiva.com/2553/pyu-r-int-thick-7-2553200.pdf?src-supplier=Digi-Key; ComponentLink5URL: https://datasheet.ciiva.com/15189/getdatasheetpartid-251817-15189388.pdf?src-supplier=Verical; ComponentLink5Description: https://datasheet.ciiva.com/15189/getdatasheetpartid-251817-15189388.pdf?src-supplier=Verical; Supplier Part Number 1: 82AH7906
SW1 = MECH PB SPST TL3305AF160QG: TL3305A Series SPST 12 V 4.5 x 4.5 mm 160 gf Top Actuated SMT Tactile Switch; Manufacturer: E-Switch; Mechanical Life: 500000Cycles; Illumination Type: Non-Illuminated; Operating Force: 160gf; Switch Travel: 0.2mm; Switch Function: Off-Mom; Actuator Type: Standard; Supplier 1: Newark; Manufacturer Part Number: TL3305AF160QG; RoHS: Yes; Category: Tactile Switches; Stock 1: 19079; Pricing 1: 1=0.22000, 10=0.21000, 25=0.20000, 50=0.19000, 100=0.18000, 250=0.17000 (USD); Mount: Surface Mount; Min Operating Temperature: -20°C; Max Operating Temperature: 70°C; Packaging: Tape and Reel; Termination: Gull Wing; Throw Configuration: SPST; Lead Free: Lead Free; RoHS Compliant: Yes; ComponentLink1URL: http://www.farnell.com/datasheets/2554191.pdf?src-supplier=Farnell; ComponentLink1Description: http://www.farnell.com/datasheets/2554191.pdf?src-supplier=Farnell; ComponentLink2URL: http://www.farnell.com/datasheets/2554191.pdf?src-supplier=Newark; ComponentLink2Description: http://www.farnell.com/datasheets/2554191.pdf?src-supplier=Newark; ComponentLink3URL: http://spec_sheets.e-switch.com/specs/P010468.pdf?src-supplier=Digi-Key; ComponentLink3Description: http://spec_sheets.e-switch.com/specs/P010468.pdf?src-supplier=Digi-Key; Supplier Part Number 1: 84Y2774
TP1-TP13 TP18 TP19 TP22 TP24-TP38 = TP 1mm: SMT testpoint
TP14-TP17 TP20 TP21 TP23 = TP U.FL: CONN U.FL RCPT STR 50 OHM SMD; Manufacturer: Hirose; Manufacturer Part Number: U.FL-R-SMT-1(80); Body Material: Bronze; Body Plating: Silver; Center Contact Plating: Gold; Dielectric Material: Polymer; Connector Type: Receptacle,Male Pin; Impedance: 50R; Max Frequency: 6GHz; Number of Ports: 1; Mating Cycles: 30; Supplier 1: Future Electronics; RoHS: Yes; Category: RF / Coaxial Connectors; Stock 1: 40000; Pricing 1: 10000=0.81500, 20000=0.80000, 30000=0.78500 (USD); Mount: Surface Mount; Case/Package: SMD/SMT; Contact Material: Brass; Housing Color: Beige; Min Operating Temperature: -40°C; Max Operating Temperature: 90°C; Package Quantity: 10000; Packaging: Tape and Reel; Fastening Type: SNAP-ON; Series: U.FL; Termination: Solder; Lead Free: Lead Free; RoHS Compliant: Yes; ComponentLink1URL: http://www.mouser.com/ds/2/185/U.FL_catalog-939761.pdf?src-supplier=Mouser; ComponentLink1Description: http://www.mouser.com/ds/2/185/U.FL_catalog-939761.pdf?src-supplier=Mouser; ComponentLink2URL: https://www.hirose.com/product/en/download_file/key_name/U.FL-R-SMT-1%2880%29/category/Specification%20Sheet/doc_file_id/37638/?file_category_id=9&item_id=03310472280&is_series=&src-supplier=Digi-Key; ComponentLink2Description: https://www.hirose.com/product/en/download_file/key_name/U.FL-R-SMT-1%2880%29/category/Specification%20Sheet/doc_file_id/37638/?file_category_id=9&item_id=03310472280&is_series=&src-supplier=Digi-Key
U1 = IC REG BOOST 28V 1A2 TPS61046YFFR: 28-V Output Voltage Boost Converter in WCSP Package 6-DSBGA -40 to 125; Manufacturer: Texas Instruments; Quiescent Current: 110uA; Supplier 1: Digi-Key; Manufacturer Part Number: TPS61046YFFR; RoHS: Yes; Category: Voltage Regulators - Switching; Stock 1: 82158; Pricing 1: 1=1.29000, 10=1.15700, 25=1.09800, 100=0.90210, 250=0.84324, 500=0.74518, 1000=0.58830 (USD); Min Operating Temperature: -40°C; Max Operating Temperature: 85°C; Topology: Boost; Lead Free: Lead Free; RoHS Compliant: Yes; ComponentLink1URL: http://www.ti.com/lit/ds/symlink/tps61046.pdf?src-supplier=Digi-Key; ComponentLink1Description: http://www.ti.com/lit/ds/symlink/tps61046.pdf?src-supplier=Digi-Key; ComponentLink2URL: http://www.ti.com/general/docs/suppproductinfo.tsp?distId=10&amp;gotoUrl=http%3A%2F%2Fwww.ti.com%2Flit%2Fgpn%2Ftps61046&src-supplier=Digi-Key; ComponentLink2Description: http://www.ti.com/general/docs/suppproductinfo.tsp?distId=10&amp;gotoUrl=http%3A%2F%2Fwww.ti.com%2Flit%2Fgpn%2Ftps61046&src-supplier=Digi-Key; ComponentLink3URL: http://www.ti.com/general/docs/lit/getliterature.tsp?genericPartNumber=TPS61046&&fileType=pdf&src-supplier=Avnet; ComponentLink3Description: http://www.ti.com/general/docs/lit/getliterature.tsp?genericPartNumber=TPS61046&&fileType=pdf&src-supplier=Avnet; Supplier Part Number 1: 296-44337-1-ND
U2 U3 = IC OPAMP SOT5/6-23 GENERIC: Number of Channels: 1; RoHS: Yes; Category: Amplifiers - Op Amps, Buffer, Instrumentation; Mount: Surface Mount; Case/Package: SOT; Number of Pins: 6; Number of Circuits: 1; RoHS Compliant: Yes
U4 = IC OPAMP SOT5/6-23 GENERIC: Manufacturer 1: Texas Instruments; Number of Channels: 1; RoHS: Yes; Category: Amplifiers - Op Amps, Buffer, Instrumentation; Mount: Surface Mount; Case/Package: SOT; Number of Pins: 6; Number of Circuits: 1; RoHS Compliant: Yes; Manufacturer Part Number 1: TLV3541IDBVR
U5 = IC GPIO EXPANDER 16B I2C TCA9535RTWR: IC I/O EXPANDER I2C 16B 24WQFN / I2C/SMBus Interface 100kHz/400kHz 5.5V 24-Pin WQFN EP T/R; Manufacturer 1: Texas Instruments; Category 1: Integrated Circuits (ICs); Number of I/Os: 16; Min Supply Voltage: 1.65V; Frequency: 400kHz; Output Type: PUSH-PULL; Supplier 1: Mouser; Supplier Part Number 1: 595-TCA9535RTWR; Manufacturer Part Number 1: TCA9535RTWR; RoHS 1: Yes; Description 1: IC I/O EXPANDER I2C 16B 24WQFN / I2C/SMBus Interface 100kHz/400kHz 5.5V 24-Pin WQFN EP T/R; Stock 1: 4729; Pricing 1: 1=1.28, 10=1.15, 50=1.09, 100=0.895, 1000=0.584, 10000=0.513 (USD); Case/Package: QFN; Pins: 24; Min Operating Temperature: -40°C; Max Operating Temperature: 85°C; Package Quantity: 3000; Packaging: Tape and Reel; Max Supply Voltage: 5.5V; Clock Frequency: 400kHz; Series: -; Reach SVHC Compliant: No; Lead Free: Lead Free; RoHS Compliant: Yes; ComponentLink1URL: https://datasheet.ciiva.com/1780/tca9535-1780418.pdf?src-supplier=Digi-Key; ComponentLink1Description: https://datasheet.ciiva.com/1780/tca9535-1780418.pdf?src-supplier=Digi-Key; ComponentLink2URL: https://datasheet.ciiva.com/41460/001187868-da-01-en-ic-i-o-expander-tca9535rtwr-wqfn-24-tid-41460608.pdf?src-supplier=Conrad; ComponentLink2Description: https://datasheet.ciiva.com/41460/001187868-da-01-en-ic-i-o-expander-tca9535rtwr-wqfn-24-tid-41460608.pdf?src-supplier=Conrad; ComponentLink3URL: https://datasheet.ciiva.com/14195/tca9535-14195183.pdf?src-supplier=Avnet; ComponentLink3Description: https://datasheet.ciiva.com/14195/tca9535-14195183.pdf?src-supplier=Avnet; ComponentLink4URL: https://datasheet.ciiva.com/1780/tca9535-1780419.pdf?src-supplier=Digi-Key; ComponentLink4Description: https://datasheet.ciiva.com/1780/tca9535-1780419.pdf?src-supplier=Digi-Key; ComponentLink5URL: https://datasheet.ciiva.com/1780/tca9535-1780420.pdf?src-supplier=Digi-Key; ComponentLink5Description: https://datasheet.ciiva.com/1780/tca9535-1780420.pdf?src-supplier=Digi-Key

## Assembly variants
V0.1.0: not fitted C16 R20 R24 R25